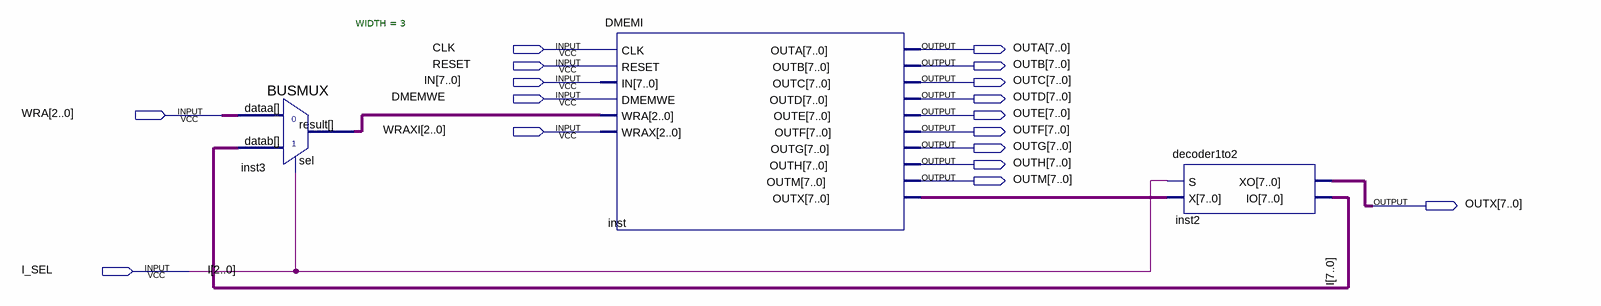
[diagram p0: schematic sheet]
// Quartus schematic DMEM.bdf as structural Verilog: 3 symbols, 17 pins
module DMEM (
  input  CLK,
  input  RESET,
  input  [7:0] IN,
  input  DMEMWE,
  input  [2:0] WRA,
  input  [2:0] WRAXI,
  input  I_SEL,
  output [7:0] OUTA,
  output [7:0] OUTB,
  output [7:0] OUTC,
  output [7:0] OUTD,
  output [7:0] OUTE,
  output [7:0] OUTF,
  output [7:0] OUTG,
  output [7:0] OUTH,
  output [7:0] OUTM,
  output [7:0] OUTX
);

  wire [2:0] inst3_result;
  wire [7:0] I, inst_outx;

  BUSMUX #(.WIDTH(3)) inst3 (.datab(I[2:0]), .sel(I_SEL), .dataa(WRA), .result(inst3_result));
  DMEMI inst (
    .CLK(CLK), .RESET(RESET), .IN(IN), .DMEMWE(DMEMWE), .WRA(inst3_result), .WRAX(WRAXI), .OUTA(OUTA),
    .OUTB(OUTB), .OUTC(OUTC), .OUTD(OUTD), .OUTE(OUTE), .OUTF(OUTF), .OUTG(OUTG), .OUTH(OUTH), .OUTM(OUTM),
    .OUTX(inst_outx));
  decoder1to2 inst2 (.S(I_SEL), .X(inst_outx), .XO(OUTX), .IO(I));
endmodule
